# Altium schematic sheet Cpt_Temp.SchDoc
size A4
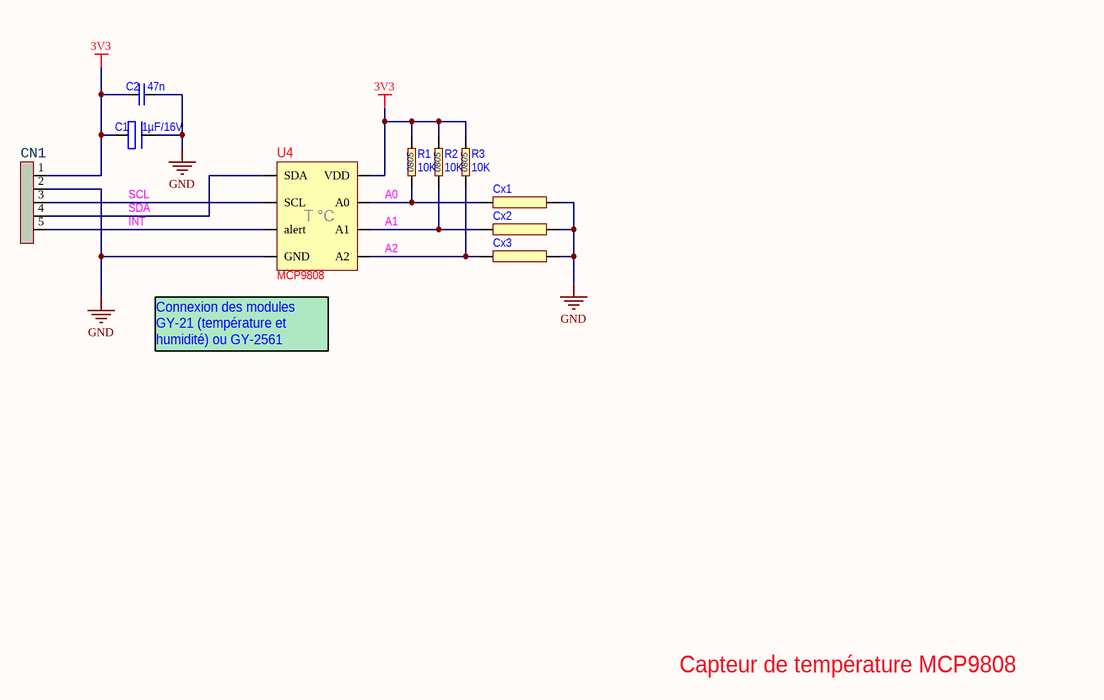
[diagram p0: Cpt_Temp.SchDoc]

## Parts
C1  1µF/16V  [3216-18]
C2  47n  [0805]
CN1  inch_ligne 1x5  [INCH_1x5_droit]  (value not drawn)
Cx1  Pont  [0402]  (value not drawn)
Cx2  Pont  [0402]  (value not drawn)
Cx3  Pont  [0402]  (value not drawn)
R1  10K  [0805]
R2  10K  [0805]
R3  10K  [0805]
U4  MCP9808  [MSOP-08]

## Nets
3V3: C1.1(V+) C2.1(CT1) CN1.1 R1.2(CT2) R2.2(CT2) R3.2(CT2) U4.8(VDD)
GND: C1.2(V-) C2.2(CT2) CN1.2 Cx1.2(P2) Cx2.2(P2) Cx3.2(P2) U4.4(GND)
A0: Cx1.1(P1) R1.1(CT1) U4.7(A0)
A1: Cx2.1(P1) R2.1(CT1) U4.6(A1)
A2: Cx3.1(P1) R3.1(CT1) U4.5(A2)
INT: CN1.5 U4.3(alert)
SCL: CN1.3 U4.2(SCL)
SDA: CN1.4 U4.1(SDA)

## Notes on the sheet
- (near U4) Connexion des modules GY-21 (température et humidité) ou GY-2561 (Luxmètre)
- Capteur de température MCP9808
- (in symbol MCP9808) T °C
- (in symbol Res CMS 0805) 0805

## Library data of the parts
C1 = tantale 1µF/16V: 145-7406 case 3216-18
C2 = Cap_CMS_0805: CMS 0805
CN1 = Inch_1x5_droit
Cx1-Cx3 = Pont: Pont pour configuration I2C
R1-R3 = Res CMS 0805: CMS 0805
U4 = MCP9808: Digital temperature Sensor